# Altium schematic sheet LCD_GH08172.SchDoc
size A4; DocumentNumber: 4; Revision: C.1(PCB.SCH); SheetNumber: 4; SheetTotal: 6
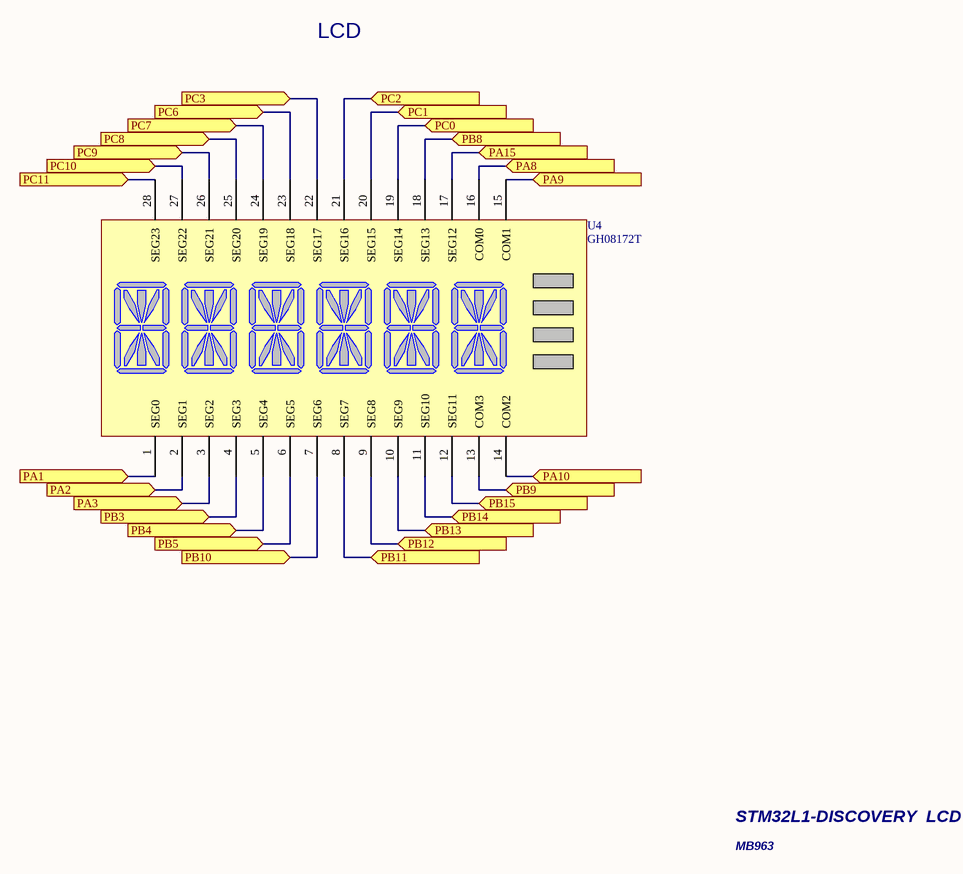
[diagram p0: LCD_GH08172.SchDoc]

## Parts
U4  GH08172T  [DIP28]

## Ports
PA1 (in), PA2 (in), PA3 (in), PA8 (in), PA9 (in), PA10 (in), PA15 (in), PB3 (in), PB4 (in), PB5 (in), PB8 (in), PB9 (in), PB10 (in), PB11 (in), PB12 (in), PB13 (in), PB14 (in), PB15 (in), PC0 (in), PC1 (in), PC2 (in), PC3 (in), PC6 (in), PC7 (in), PC8 (in), PC9 (in), PC10 (in), PC11 (in)

## Nets
PA1: U4.1(SEG0) ; port PA1
PA2: U4.2(SEG1) ; port PA2
PA3: U4.3(SEG2) ; port PA3
PA8: U4.16(COM0) ; port PA8
PA9: U4.15(COM1) ; port PA9
PA10: U4.14(COM2) ; port PA10
PA15: U4.17(SEG12) ; port PA15
PB3: U4.4(SEG3) ; port PB3
PB4: U4.5(SEG4) ; port PB4
PB5: U4.6(SEG5) ; port PB5
PB8: U4.18(SEG13) ; port PB8
PB9: U4.13(COM3) ; port PB9
PB10: U4.7(SEG6) ; port PB10
PB11: U4.8(SEG7) ; port PB11
PB12: U4.9(SEG8) ; port PB12
PB13: U4.10(SEG9) ; port PB13
PB14: U4.11(SEG10) ; port PB14
PB15: U4.12(SEG11) ; port PB15
PC0: U4.19(SEG14) ; port PC0
PC1: U4.20(SEG15) ; port PC1
PC2: U4.21(SEG16) ; port PC2
PC3: U4.22(SEG17) ; port PC3
PC6: U4.23(SEG18) ; port PC6
PC7: U4.24(SEG19) ; port PC7
PC8: U4.25(SEG20) ; port PC8
PC9: U4.26(SEG21) ; port PC9
PC10: U4.27(SEG22) ; port PC10
PC11: U4.28(SEG23) ; port PC11

## Notes on the sheet
- LCD
- STM32L1-DISCOVERY  LCD
- MB963
- STMicroelectronics
- Title:
- Number:
- Rev:
- Date:
- Sheet       of

## Library data of the parts
U4 = GH08172T: LCD 24 Seg x 4 Com with SOCKET